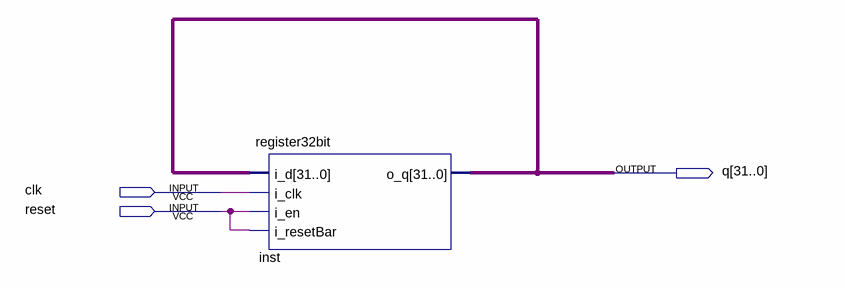
[diagram p0: schematic sheet]
// Quartus schematic testBlockUnit.bdf as structural Verilog: 1 symbols, 3 pins
module testBlockUnit (
  input  clk,
  input  reset,
  output [31:0] q
);

  register32bit inst (.i_d(q), .i_clk(clk), .i_en(reset), .i_resetBar(reset), .o_q(q));
endmodule
